# Altium schematic sheet Eeprom.SchDoc: Oven Driver
size A4; DrawnBy: Łukasz Przeniosło; Organization: Altium Limited; Address1: L3, 12a Rodborough Rd; Address2: Frenchs Forest; Address3: NSW; Address4: Australia 2086; DocumentNumber: 12; SheetNumber: 12; SheetTotal: 13; Number: MS02-50-42-00; Time: Oven Driver
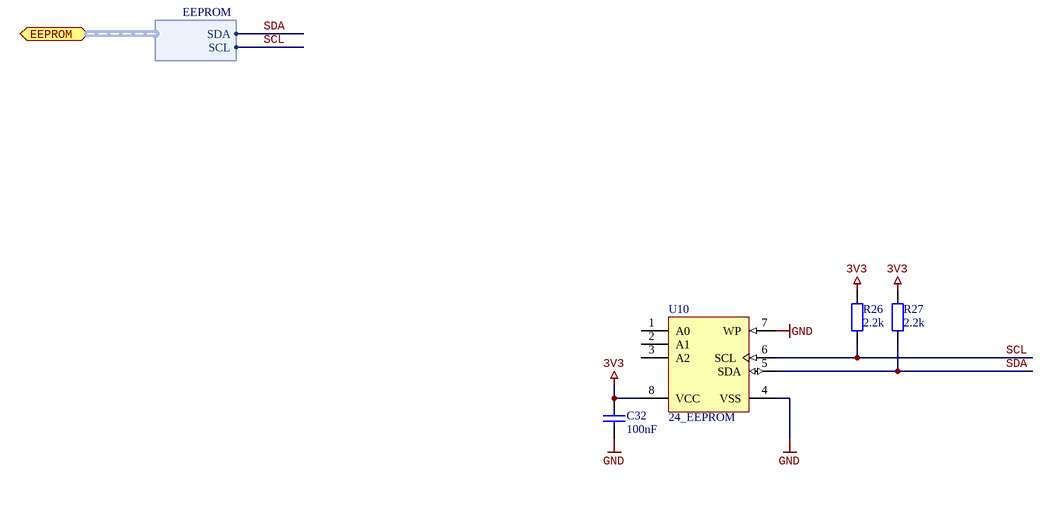
[diagram p0: Eeprom.SchDoc]

## Parts
C32  100nF  [CAPC1608N]
R26  2.2k  [RESC1608N]
R27  2.2k  [RESC1608N]
U10  24_EEPROM  [SO-8_L]

## Ports
EEPROM (harness EEPROM)

## Harnesses
EEPROM: SDA, SCL

## Nets
3V3: C32.1 R26.1 R27.1 U10.8(VCC)
GND: C32.2 U10.4(VSS) U10.7(WP)
SCL: R26.2 U10.6(SCL) ; port EEPROM.SCL
SDA: R27.2 U10.5(SDA) ; port EEPROM.SDA

Not connected (* = marked no-connect by the designer): U10 1(A0) 2(A1) 3(A2)

## Notes on the sheet
- Title:
- Date:
- Drawn by:
- Project:
- Time:
- Number:
- Sheet
- of
- File:

## Library data of the parts
C32 = Capacitor: Value: 100nF
R26 R27 = Resistor: Power: 0W; Tolerance: 5%; Value: 2.2k
U10 = 24_EEPROM: 16Kbit, 400kHz, 2.5V, I2C Serial EEPROM, 8-Pin SOIC 150mil, Extended Temperature; DatasheetVersion: revA, Nov-2008; Code_JEDEC: MS-012; PackageDescription: 8-Lead Plastic Small Outline (SN) - Narrow, 3.90mm Body [SOIC]; Code_IPC: SOIC127P600-8; PackageReference: SOIC-SN8; PackageVersion: revBB, Aug-2009